# Altium schematic sheet 1.2.0_XBee_module.SchDoc
size A4; DocumentNumber: 10; SheetNumber: 10; SheetTotal: 14
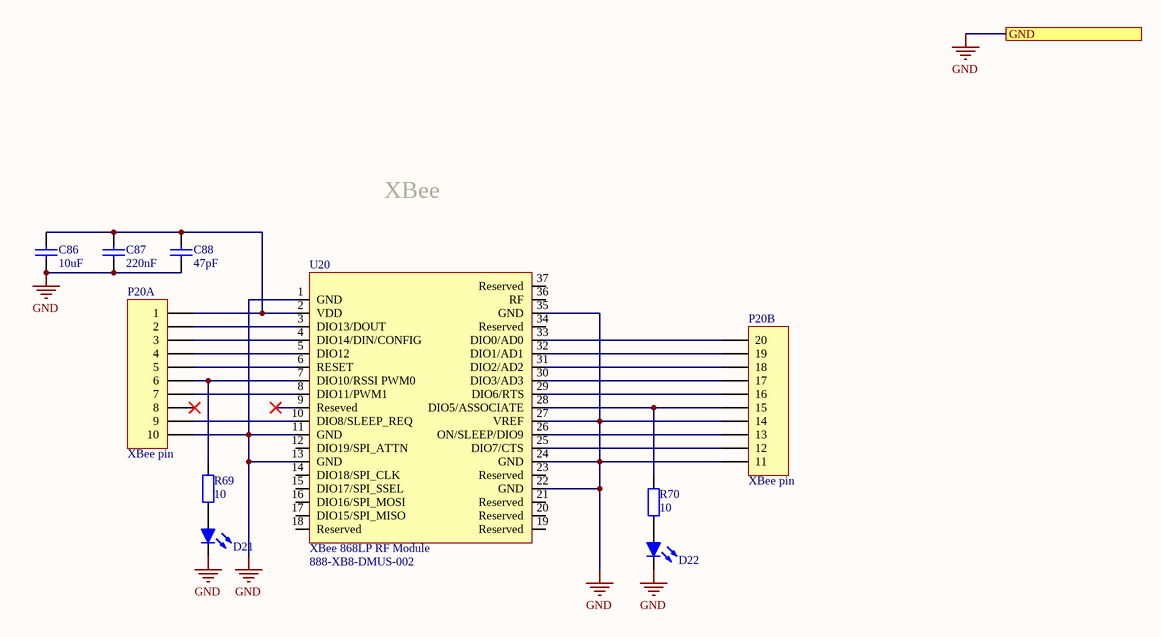
[diagram p0: 1.2.0_XBee_module.SchDoc]

## Parts
C86  10uF  [CAP0805W]
C87  220nF  [CAP0603R]
C88  47pF  [CAP0603R]
D21  LED  [WL-SMCW]  (value not drawn)
D22  LED  [WL-SMCW]  (value not drawn)
P20  XBee pin  [XBEE PIN]  (parts A,B of 2)
R69  10  [0603]
R70  10  [0603]
U20  XBee 868LP RF Module  Supplier Part Number 1: 888-XB8-DMUS-002  [XBee 868LP RF Module]

## Ports
GND

## Nets
GND: C86.1 C87.1 C88.1 D21.C D22.C P20.10 P20.11 P20.14 U20.1(GND) U20.11(GND) U20.13(GND) U20.22(GND) U20.24(GND) U20.27(VREF) U20.35(GND) ; port GND
NetC86_2: C86.2 C87.2 C88.2 P20.1 U20.2(VDD)
NetD21_A: D21.A R69.1
NetD22_A: D22.A R70.1
NetP20_2: P20.2 U20.3(DIO13/DOUT)
NetP20_3: P20.3 U20.4(DIO14/DIN/CONFIG)
NetP20_4: P20.4 U20.5(DIO12)
NetP20_5: P20.5 U20.6(RESET)
NetP20_6: P20.6 R69.2 U20.7(DIO10/RSSI_PWM0)
NetP20_7: P20.7 U20.8(DIO11/PWM1)
NetP20_9: P20.9 U20.10(DIO8/SLEEP_REQ)
NetP20_12: P20.12 U20.25(DIO7/CTS)
NetP20_13: P20.13 U20.26(ON/SLEEP/DIO9)
NetP20_15: P20.15 R70.2 U20.28(DIO5/ASSOCIATE)
NetP20_16: P20.16 U20.29(DIO6/RTS)
NetP20_17: P20.17 U20.30(DIO3/AD3)
NetP20_18: P20.18 U20.31(DIO2/AD2)
NetP20_19: P20.19 U20.32(DIO1/AD1)
NetP20_20: P20.20 U20.33(DIO0/AD0)

Not connected (* = marked no-connect by the designer): P20 8*; U20 9(Reseved)* 12(DIO19/SPI_ATTN) 14(DIO18/SPI_CLK) 15(DIO17/SPI_SSEL) 16(DIO16/SPI_MOSI) 17(DIO15/SPI_MISO) 18(Reserved) 19(Reserved) 20(Reserved) 21(Reserved) 23(Reserved) 34(Reserved) 36(RF) 37(Reserved)

## Notes on the sheet
- XBee

## Library data of the parts
C86 = C_10uF_16v: Capacitor; Supplier 1: Mouser; Supplier Part Number 1: 81-GRT21BC81C106ME1L
C87 = C_220nF: Capacitor; Supplier 1: Mouser; Supplier Part Number 1: 81-GCG188R91H224KA1D
C88 = C_47pF_25V: Capacitor; Supplier 1: Mouser; Supplier Part Number 1: 77-VJ0603A470JXXPBC
D21 D22 = LED_SMD_GREEN_0603: Standard LEDs - SMD WL-SMCW Waterclr 0603 Green; Supplier 1: Mouser; Supplier Part Number 1: 710-150060GS75000
R69 R70 = R_0603_025W_10Ohm: 0.25W 10Ohm; Supplier 1: Mouser; Supplier Part Number 1: 667-ERJ-PA3J100V
U20 = XBee 868LP RF Module: Supplier 1: Mouser